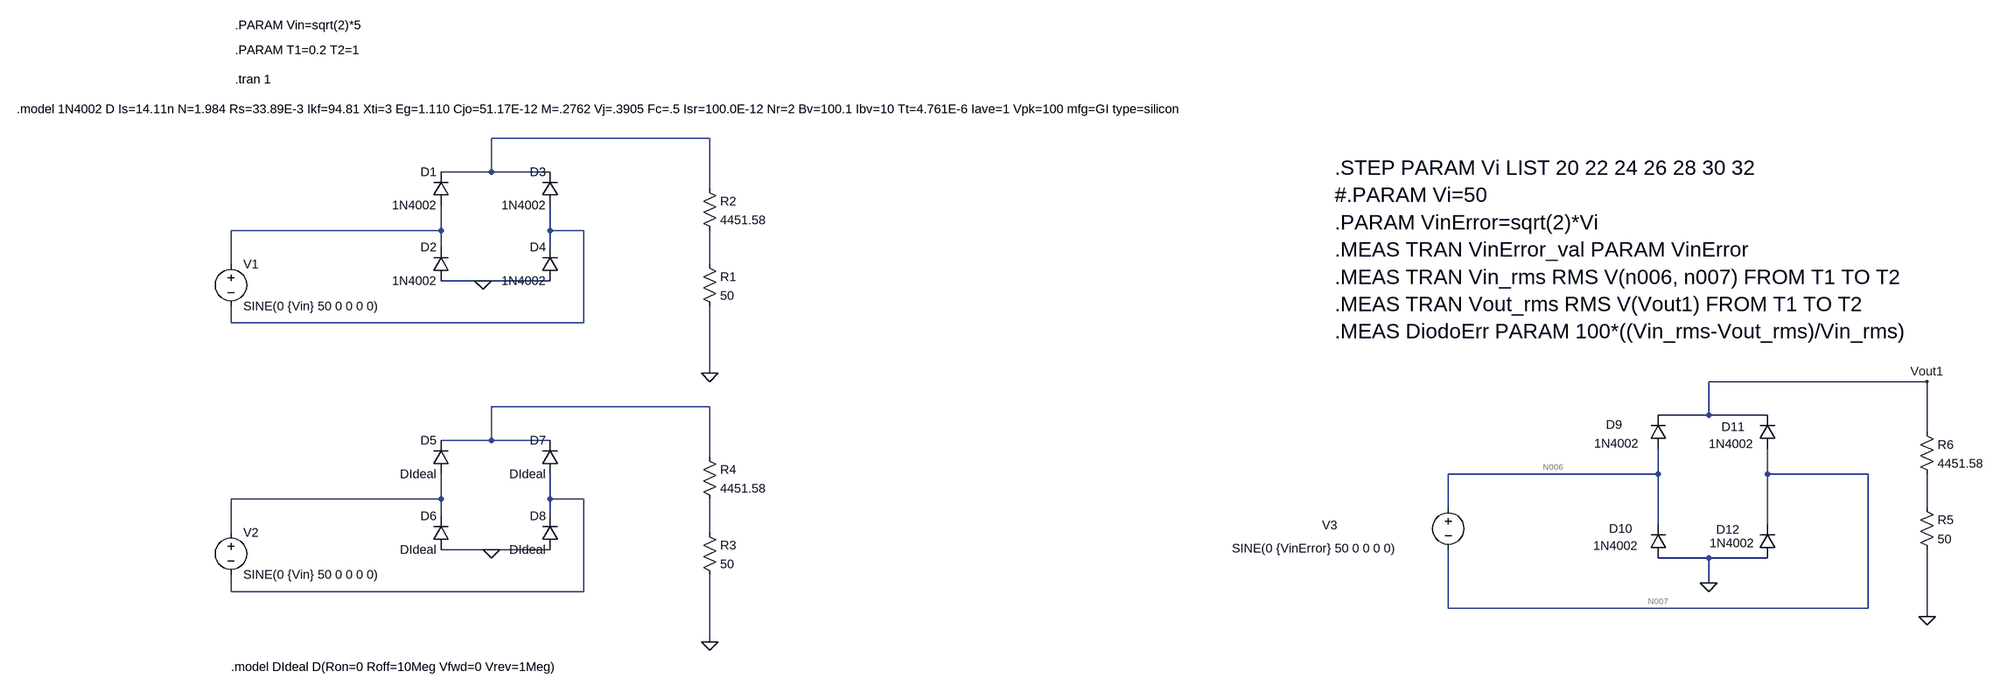
[diagram p0: schematic Problema4.asc]
Problema4.asc, the LTspice schematic file:
Version 4.1
SHEET 1 4592 928
WIRE 672 -96 256 -96
WIRE 256 -32 256 -96
WIRE 256 -32 160 -32
WIRE 368 -32 256 -32
WIRE 672 0 672 -96
WIRE 160 80 160 32
WIRE 160 80 -240 80
WIRE 368 80 368 32
WIRE 432 80 368 80
WIRE 160 112 160 80
WIRE 368 112 368 80
WIRE -240 144 -240 80
WIRE 672 144 672 80
WIRE 240 176 160 176
WIRE 368 176 240 176
WIRE -240 256 -240 224
WIRE 432 256 432 80
WIRE 432 256 -240 256
WIRE 672 352 672 224
WIRE 3616 368 3200 368
WIRE 672 416 256 416
WIRE 3200 432 3200 368
WIRE 3200 432 3104 432
WIRE 3312 432 3200 432
WIRE 3616 464 3616 368
WIRE 256 480 256 416
WIRE 256 480 160 480
WIRE 368 480 256 480
WIRE 672 512 672 416
WIRE 3104 544 3104 496
WIRE 3104 544 2704 544
WIRE 3312 544 3312 496
WIRE 3504 544 3312 544
WIRE 160 592 160 544
WIRE 160 592 -240 592
WIRE 368 592 368 544
WIRE 432 592 368 592
WIRE 2704 608 2704 544
WIRE 3616 608 3616 544
WIRE 160 624 160 592
WIRE 368 624 368 592
WIRE 3104 640 3104 544
WIRE 3312 640 3312 544
WIRE -240 656 -240 592
WIRE 672 656 672 592
WIRE 256 688 160 688
WIRE 368 688 256 688
WIRE 3200 704 3104 704
WIRE 3312 704 3200 704
WIRE 3200 752 3200 704
WIRE -240 768 -240 736
WIRE 432 768 432 592
WIRE 432 768 -240 768
WIRE 2704 800 2704 688
WIRE 3504 800 3504 544
WIRE 3504 800 2704 800
WIRE 3616 816 3616 688
WIRE 672 864 672 736
FLAG 672 352 0
FLAG 672 864 0
FLAG 256 688 0
FLAG 240 176 0
FLAG 3616 368 Vout1
FLAG 3616 816 0
FLAG 3200 752 0
SYMBOL voltage -240 128 R0
WINDOW 123 0 0 Left 0
WINDOW 39 0 0 Left 0
SYMATTR InstName V1
SYMATTR Value SINE(0 {Vin} 50 0 0 0 0)
SYMBOL res 656 128 R0
SYMATTR InstName R1
SYMATTR Value 50
SYMBOL diode 176 32 R180
WINDOW 0 24 64 Left 2
WINDOW 3 24 0 Left 2
SYMATTR InstName D1
SYMATTR Value 1N4002
SYMBOL diode 176 176 R180
WINDOW 0 24 64 Left 2
WINDOW 3 24 0 Left 2
SYMATTR InstName D2
SYMATTR Value 1N4002
SYMBOL diode 384 32 R180
WINDOW 0 24 64 Left 2
WINDOW 3 24 0 Left 2
SYMATTR InstName D3
SYMATTR Value 1N4002
SYMBOL diode 384 176 R180
WINDOW 0 24 64 Left 2
WINDOW 3 24 0 Left 2
SYMATTR InstName D4
SYMATTR Value 1N4002
SYMBOL voltage -240 640 R0
WINDOW 123 0 0 Left 0
WINDOW 39 0 0 Left 0
SYMATTR InstName V2
SYMATTR Value SINE(0 {Vin} 50 0 0 0 0)
SYMBOL res 656 640 R0
SYMATTR InstName R3
SYMATTR Value 50
SYMBOL diode 176 544 R180
WINDOW 0 24 64 Left 2
WINDOW 3 24 0 Left 2
SYMATTR InstName D5
SYMATTR Value DIdeal
SYMBOL diode 176 688 R180
WINDOW 0 24 64 Left 2
WINDOW 3 24 0 Left 2
SYMATTR InstName D6
SYMATTR Value DIdeal
SYMBOL diode 384 544 R180
WINDOW 0 24 64 Left 2
WINDOW 3 24 0 Left 2
SYMATTR InstName D7
SYMATTR Value DIdeal
SYMBOL diode 384 688 R180
WINDOW 0 24 64 Left 2
WINDOW 3 24 0 Left 2
SYMATTR InstName D8
SYMATTR Value DIdeal
SYMBOL res 656 496 R0
SYMATTR InstName R4
SYMATTR Value 4451.58
SYMBOL res 656 -16 R0
SYMATTR InstName R2
SYMATTR Value 4451.58
SYMBOL voltage 2704 592 R0
WINDOW 123 0 0 Left 0
WINDOW 39 0 0 Left 0
WINDOW 0 -240 50 Left 2
WINDOW 3 -412 94 Left 2
SYMATTR InstName V3
SYMATTR Value SINE(0 {VinError} 50 0 0 0 0)
SYMBOL diode 3120 496 R180
WINDOW 0 85 46 Left 2
WINDOW 3 53 10 Left 2
SYMATTR InstName D9
SYMATTR Value 1N4002
SYMBOL diode 3120 704 R180
WINDOW 0 65 56 Left 2
WINDOW 3 55 23 Left 2
SYMATTR InstName D10
SYMATTR Value 1N4002
SYMBOL diode 3328 496 R180
WINDOW 0 59 42 Left 2
WINDOW 3 43 9 Left 2
SYMATTR InstName D11
SYMATTR Value 1N4002
SYMBOL diode 3328 704 R180
WINDOW 0 69 54 Left 2
WINDOW 3 41 28 Left 2
SYMATTR InstName D12
SYMATTR Value 1N4002
SYMBOL res 3600 592 R0
SYMATTR InstName R5
SYMATTR Value 50
SYMBOL res 3600 448 R0
SYMATTR InstName R6
SYMATTR Value 4451.58
TEXT -232 -208 Left 2 !.tran 1
TEXT -232 -312 Left 2 !.PARAM Vin=sqrt(2)*5
TEXT -648 -152 Left 2 !.model 1N4002 D Is=14.11n N=1.984 Rs=33.89E-3 Ikf=94.81 Xti=3 Eg=1.110 Cjo=51.17E-12 M=.2762 Vj=.3905 Fc=.5 Isr=100.0E-12 Nr=2 Bv=100.1 Ibv=10 Tt=4.761E-6 Iave=1 Vpk=100 mfg=GI type=silicon
TEXT -240 912 Left 2 !.model DIdeal D(Ron=0 Roff=10Meg Vfwd=0 Vrev=1Meg)
TEXT 2488 -40 Left 4 !.STEP PARAM Vi LIST 20 22 24 26 28 30 32\n#.PARAM Vi=50\n.PARAM VinError=sqrt(2)*Vi\n.MEAS TRAN VinError_val PARAM VinError\n.MEAS TRAN Vin_rms RMS V(n006, n007) FROM T1 TO T2\n.MEAS TRAN Vout_rms RMS V(Vout1) FROM T1 TO T2\n.MEAS DiodoErr PARAM 100*((Vin_rms-Vout_rms)/Vin_rms)
TEXT -232 -264 Left 2 !.PARAM T1=0.2 T2=1

The netlist it stands for:
* Problema4.asc
V1 N002 N003 SINE(0 {Vin} 50 0 0 0 0)
R1 N004 0 50
D1 N002 N001 1N4002
D2 0 N002 1N4002
D3 N003 N001 1N4002
D4 0 N003 1N4002
V2 N008 N009 SINE(0 {Vin} 50 0 0 0 0)
R3 N011 0 50
D5 N008 N005 DIdeal
D6 0 N008 DIdeal
D7 N009 N005 DIdeal
D8 0 N009 DIdeal
R4 N005 N011 4451.58
R2 N001 N004 4451.58
V3 N006 N007 SINE(0 {VinError} 50 0 0 0 0)
D9 N006 Vout1 1N4002
D10 0 N006 1N4002
D11 N007 Vout1 1N4002
D12 0 N007 1N4002
R5 N010 0 50
R6 Vout1 N010 4451.58
.model D D
.lib standard.dio
.tran 1
.PARAM Vin=sqrt(2)*5
.model 1N4002 D Is=14.11n N=1.984 Rs=33.89E-3 Ikf=94.81 Xti=3 Eg=1.110 Cjo=51.17E-12 M=.2762 Vj=.3905 Fc=.5 Isr=100.0E-12 Nr=2 Bv=100.1 Ibv=10 Tt=4.761E-6 Iave=1 Vpk=100 mfg=GI type=silicon
.model DIdeal D(Ron=0 Roff=10Meg Vfwd=0 Vrev=1Meg)
.STEP PARAM Vi LIST 20 22 24 26 28 30 32
#.PARAM Vi=50
.PARAM VinError=sqrt(2)*Vi
.MEAS TRAN VinError_val PARAM VinError
.MEAS TRAN Vin_rms RMS V(n006, n007) FROM T1 TO T2
.MEAS TRAN Vout_rms RMS V(Vout1) FROM T1 TO T2
.MEAS DiodoErr PARAM 100*((Vin_rms-Vout_rms)/Vin_rms)
.PARAM T1=0.2 T2=1
.backanno
.end